# Altium project TrollUsbAltiumBro.PrjPcb
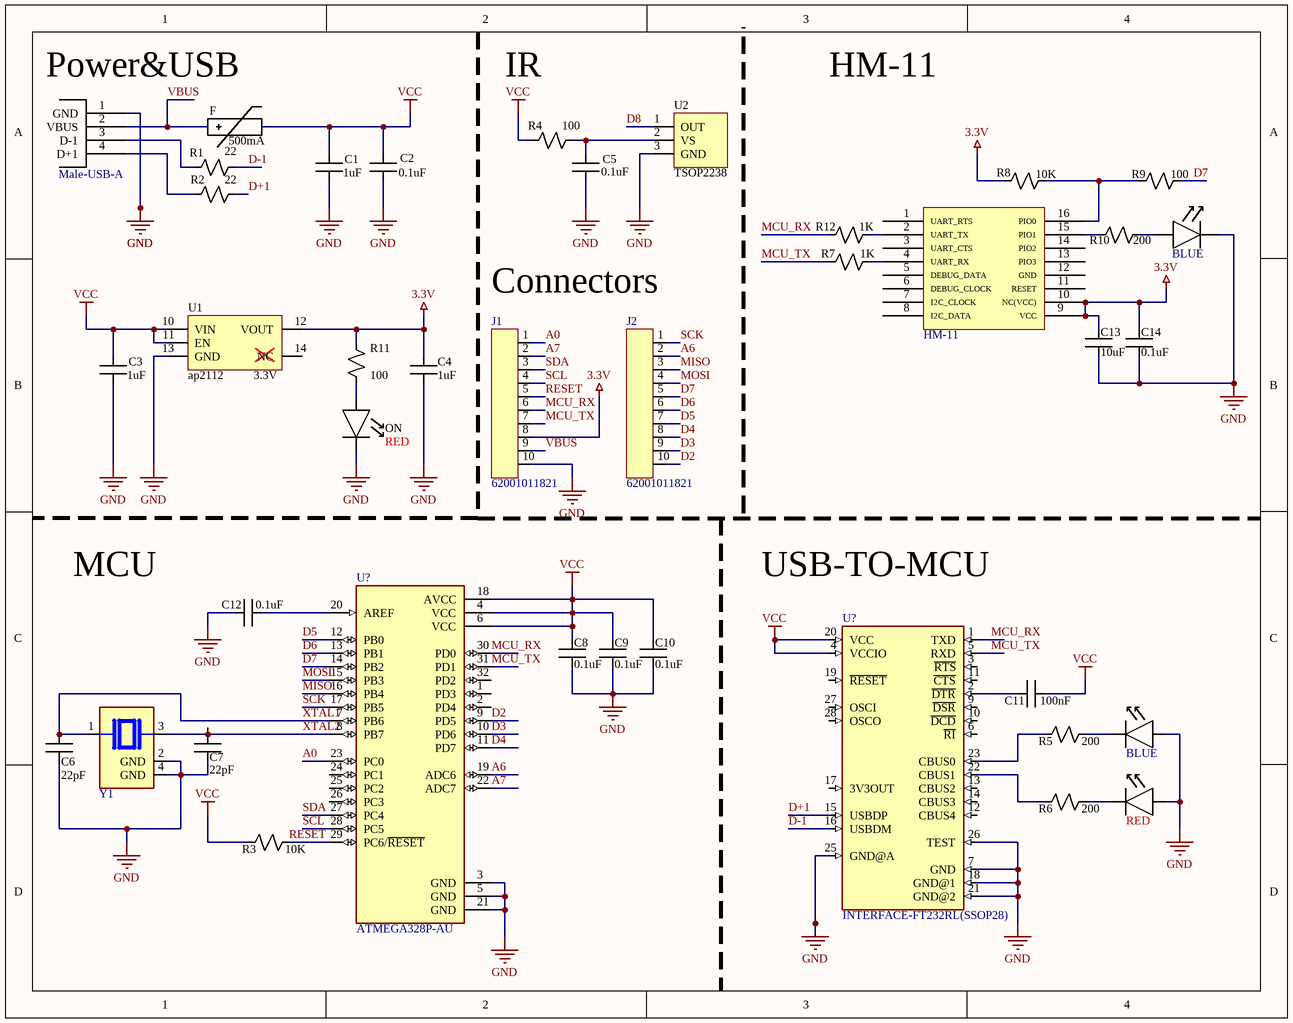
[diagram p0: Trollusbaltiumbro.SchDoc]
1 sheet, 40 parts. Net scope: global (net labels, ports and power ports of the same name join across sheets).

## Sheet Trollusbaltiumbro.SchDoc
size A; SheetNumber: 1; SheetTotal: 1

### Parts
(Parts that share a designator on the sheet are numbered #1, #2 ... from top to bottom, then left to right.)
1  colo: BLUE  [PCBComponent_1]  (hidden comment: Component_1)
*?  Color: RED  [PCBComponent_1]  (hidden comment: Component_1)
?  Male-USB-A  [PCBComponent_1]
C1  C: C1  Capacitor: 1uF  [PCBComponent_1]  (hidden comment: Capacitor-0603)
C2  C: C2  Capacitor: 0.1uF  [PCBComponent_1]  (hidden comment: Capacitor-0603)
C3  C: C3  Capacitor: 1uF  [PCBComponent_1]  (hidden comment: Capacitor-0603)
C4  C: C4  Capacitor: 1uF  [PCBComponent_1]  (hidden comment: Capacitor-0603)
C5  C: C5  Capacitor: 0.1uF  [PCBComponent_1]  (hidden comment: Capacitor-0603)
C6  C: C6  Capacitor: 22pF  [PCBComponent_1]  (hidden comment: Capacitor-0603)
C7  C: C7  Capacitor: 22pF  [PCBComponent_1]  (hidden comment: Capacitor-0603)
C8  C: C8  Capacitor: 0.1uF  [PCBComponent_1]  (hidden comment: Capacitor-0603)
C9  C: C9  Capacitor: 0.1uF  [PCBComponent_1]  (hidden comment: Capacitor-0603)
C10  C: C10  Capacitor: 0.1uF  [PCBComponent_1]  (hidden comment: Capacitor-0603)
C11  C: C11  Capacitor: 100nF  [PCBComponent_1]  (hidden comment: Capacitor-0603)
C12  C: C12  Capacitor: 0.1uF  [PCBComponent_1]  (hidden comment: Capacitor-0603)
C13  C: C13  Capacitor: 10uF  [PCBComponent_1]  (hidden comment: Capacitor-0603)
C14  C: C14  Capacitor: 0.1uF  [PCBComponent_1]  (hidden comment: Capacitor-0603)
FUSE1  Fuse: 500mA  [PCBComponent_1]  (hidden comment: Component_1)
J1  62001011821  [62001011821]
J2  62001011821  [62001011821]
LEDBLUE  Color: BLUE  [PCBComponent_1]  (hidden comment: Component_1)
LEDRED  Situation: ON  Color: RED  [PCBComponent_1]  (hidden comment: Component_1)
R1  R?: R1  Resistor: 22  [PCBComponent_1]  (hidden comment: Resistor-0603)
R2  R?: R2  Resistor: 22  [PCBComponent_1]  (hidden comment: Resistor-0603)
R3  R?: R3  Resistor: 10K  [PCBComponent_1]  (hidden comment: Resistor-0603)
R4  R?: R4  Resistor: 100  [PCBComponent_1]  (hidden comment: Resistor-0603)
R5  R?: R5  Resistor: 200  [PCBComponent_1]  (hidden comment: Resistor-0603)
R6  R?: R6  Resistor: 200  [PCBComponent_1]  (hidden comment: Resistor-0603)
R7  R: R7  Resistor: 1K  [PCBComponent_1]  (hidden comment: Resistor-0603)
R8  R: R8  Resistor: 10K  [PCBComponent_1]  (hidden comment: Resistor-0603)
R9  R: R9  Resistor: 100  [PCBComponent_1]  (hidden comment: Resistor-0603)
R10  R: R10  Resistor: 200  [PCBComponent_1]  (hidden comment: Resistor-0603)
R11  R: R11  Resistor: 100  [PCBComponent_1]  (hidden comment: Resistor-0603)
R12  R: R12  Resistor: 1K  [PCBComponent_1]  (hidden comment: Resistor-0603)
U1  Component_1  [PCBComponent_1]  (value not drawn)
U2  Component_1  [PCBComponent_1]  (value not drawn)
U3  Component_1  [PCBComponent_1]  (value not drawn)
U?#1  ATMEGA328P-AU  [PCBComponent_1]
U?#2  INTERFACE-FT232RL(SSOP28)  [PCBComponent_1]
Y1  ABMM2-16.000MHZ-E2-T  [XTAL_ABMM2-16.000MHZ-E2-T]  (value not drawn)

### Nets
3.3V: C4.7 C13.7 C14.7 J1.8 R8.5 R11.6 U1.9(VCC) U1.10(NC(VCC)) U3.12(VOUT)
GND: 1.1 *?.1 ?.1(GND) C1.6 C2.6 C3.6 C4.6 C5.6 C6.6 C7.6 C8.6 C9.6 C10.6 C12.7 C13.6 C14.6 J1.10 LEDBLUE.2 LEDRED.2 U2.3(GND) U3.13(GND) U?#1.3(GND) U?#1.5(GND) U?#1.21(GND) U?#2.7(GND) U?#2.18(GND@1) U?#2.21(GND@2) U?#2.25(GND@A) U?#2.26(TEST) Y1.2(GND) Y1.4(GND)
VCC: C1.7 C2.7 C3.7 C8.7 C9.7 C10.7 C11.6 FUSE1.9 R3.5 R4.5 U3.10(VIN) U3.11(EN) U?#1.4(VCC) U?#1.6(VCC) U?#1.18(AVCC) U?#2.4(VCCIO) U?#2.20(VCC)
A0: J1.1 U?#1.23(PC0)
A6: J2.2 U?#1.19(ADC6)
A7: J1.2 U?#1.22(ADC7)
D2: J2.10 U?#1.9(PD5)
D3: J2.9 U?#1.10(PD6)
D4: J2.8 U?#1.11(PD7)
D5: J2.7 U?#1.12(PB0)
D6: J2.6 U?#1.13(PB1)
D7: J2.5 R9.6 U?#1.14(PB2)
D8: U2.1(OUT)
D+1: R2.6 U?#2.15(USBDP)
D-1: R1.6 U?#2.16(USBDM)
MCU_RX: J1.6 R12.5 U?#1.30(PD0) U?#2.1(TXD)
MCU_TX: J1.7 R7.5 U?#1.31(PD1) U?#2.5(RXD)
MISO: J2.3 U?#1.16(PB4)
MOSI: J2.4 U?#1.15(PB3)
RESET: J1.5 R3.6 U?#1.29(PC6/~{RESET})
SCK: J2.1 U?#1.17(PB5)
SCL: J1.4 U?#1.28(PC5)
SDA: J1.3 U?#1.27(PC4)
VBUS: ?.2(VBUS) FUSE1.8 J1.9
XTAL1: C6.7 U?#1.7(PB6) Y1.1
XTAL2: C7.7 U?#1.8(PB7) Y1.3
Net1_2: 1.2 R5.6
Net*?_2: *?.2 R6.6
Net?_3: ?.3(D-1) R1.5
Net?_4: ?.4(D+1) R2.5
NetC5_7: C5.7 R4.6 U2.2(VS)
NetC11_7: C11.7 U?#2.2(~{DTR})
NetC12_6: C12.6 U?#1.20(AREF)
NetLEDBLUE_1: LEDBLUE.1 R10.6
NetLEDRED_1: LEDRED.1 R11.5
NetR5_5: R5.5 U?#2.23(CBUS0)
NetR6_5: R6.5 U?#2.22(CBUS1)
NetR7_6: R7.6 U1.4(UART_RX)
NetR8_6: R8.6 R9.5 U1.16(PIO0)
NetR10_5: R10.5 U1.15(PIO1)
NetR12_6: R12.6 U1.2(UART_TX)

Not connected (* = marked no-connect by the designer): U1 1(UART_RTS) 3(UART_CTS) 5(DEBUG_DATA) 6(DEBUG_CLOCK) 7(I2C_CLOCK) 8(I2C_DATA) 11(RESET) 12(GND) 13(PIO3) 14(PIO2); U3 14(NC); U?#1 1(PD3) 2(PD4) 24(PC1) 25(PC2) 26(PC3) 32(PD2); U?#2 3(~{RTS}) 6(~{RI}) 9(~{DSR}) 10(~{DCD}) 11(~{CTS}) 12(CBUS4) 13(CBUS2) 14(CBUS3) 17(3V3OUT) 19(~{RESET}) 27(OSCI) 28(OSCO)

### Notes on the sheet
- (near FUSE1) Power&USB
- IR
- HM-11
- Connectors
- MCU
- USB-TO-MCU
- (in symbol Component_1) U1; ap2112          3.3V; TSOP2238; HM-11

### Library data of the parts
*? = Component_1: Situation: ON
J1 J2 = 62001011821: <b> WR-PHD 2.00mm Socket Header, 10 Pins</b>=>Code : Con_BTB_SHD_2.00_1_THT_62001011821 <br><a href="http://katalog.we-online.de/media/thumbs2/eican/thb_Con_BTB_SHD_2.00_1_THT_6200xx11821_pf2.jpg" title="Enlarge picture"> <img src="http://katalog.we-online.de/media/thumbs2/eican/thb_Con_BTB_SHD_2.00_1_THT_6200xx11821_pf2.jpg"  width="320"></a><p> Details see: <a href="http://katalog.we-online.de/en/em/PHD_2_00_SOCKET_HEADER_6200XX11821">http://katalog.we-online.de/en/em/PHD_2_00_SOCKET_HEADER_6200XX11821</a><p> Created 2014-06-03, Karrer Zheng<br> 2014 (C) WÃ¼rth Elektronik; SnapEDA_Link: https://www.snapeda.com/parts/62001011821/Wurth+Electronics+Inc./view-part/?ref=snap; Purchase-URL: https://pricing.snapeda.com/search/part/62001011821/?ref=eda; Value: *; MP: 62001011821; Availability: In Stock; Check_prices: https://www.snapeda.com/parts/62001011821/Wurth+Electronics+Inc./view-part/?ref=eda; MF: WÃ¼rth Elektronik; Package: None; Price: None
U?#1 = ATMEGA328P-AU: ATmega Series 20 MHz 32 KB Flash 2 KB SRAM 8-Bit Microcontroller - TQFP-32; Value: *; Availability: Unavailable; Price: None; Package: None; MP: ATMEGA328P-AU
U?#2 = INTERFACE-FT232RL(SSOP28): 310070022; Value: *; MP: INTERFACE-FT232RL(SSOP28); Availability: Unavailable; Package: None; Price: None
Y1 = ABMM2-16.000MHZ-E2-T: 16 MHz Â±20ppm Crystal 18pF 50 Ohms 4-SMD, No Lead; MF: Abracon LLC; Value: *; Purchase-URL: https://pricing.snapeda.com/search/part/ABMM2-16.000MHZ-E2-T/?ref=eda; Package: None; Availability: In Stock; SnapEDA_Link: https://www.snapeda.com/parts/ABMM2-16.000MHZ-E2-T/Abracon+LLC/view-part/?ref=snap; MP: ABMM2-16.000MHZ-E2-T; Check_prices: https://www.snapeda.com/parts/ABMM2-16.000MHZ-E2-T/Abracon+LLC/view-part/?ref=eda; Price: None
1 FUSE1 LEDBLUE LEDRED U1-U3 = Component_1
  FUSE1: F: F